# EAGLE schematic ledy  (EAGLE 7.2.0)
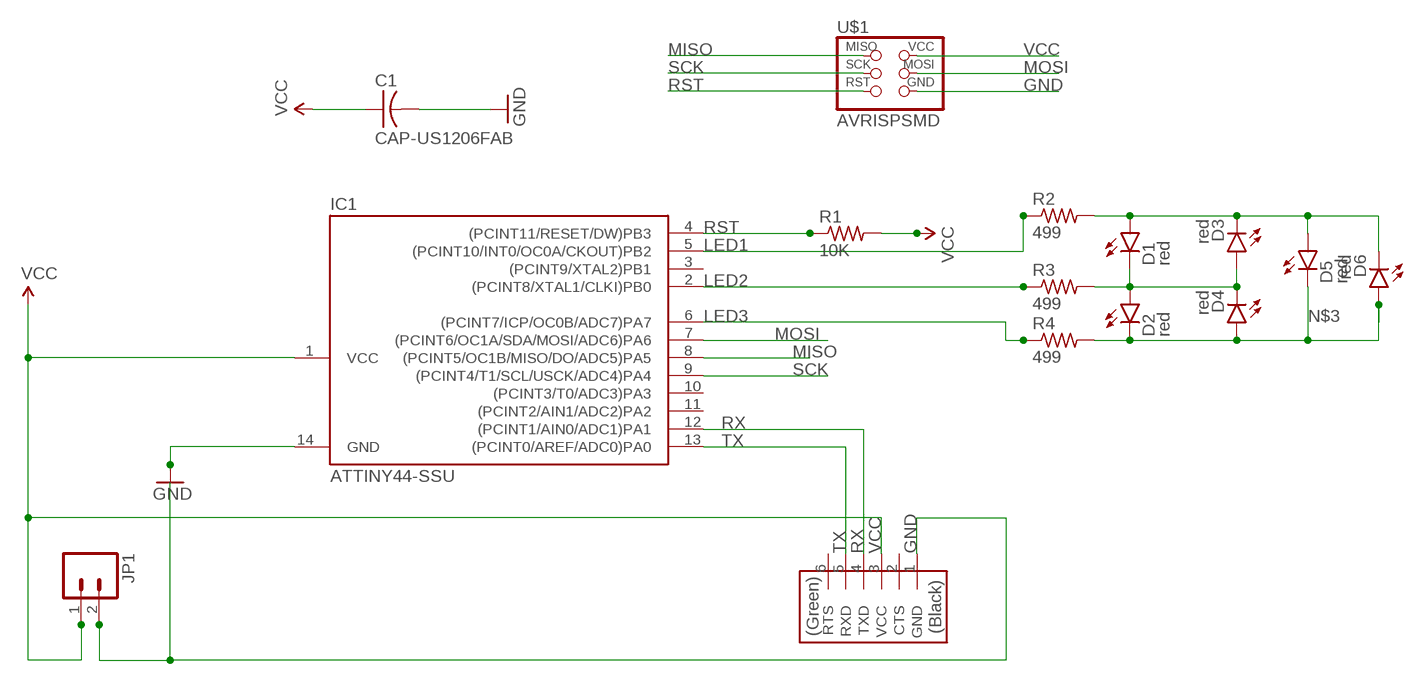
[diagram p0: schematic, sheet 1]

## Parts
C1  CAP-US1206FAB  [C1206FAB]
D1  red  LED1206  [LED-1206]
D2  red  LED1206  [LED-1206]
D3  red  LED1206  [LED-1206]
D4  red  LED1206  [LED-1206]
D5  red  LED1206  [LED-1206]
D6  red  LED1206  [LED-1206]
IC1  ATTINY44-SSU  [SOIC14]
JP1  M02PTH  [1X02]
R1  10K  RES-US1206W  [R1206W]
R2  499  RES-US1206W  [R1206W]
R3  499  RES-US1206W  [R1206W]
R4  499  RES-US1206W  [R1206W]
U$1  AVRISPSMD  [2X03SMD]
U$3  FTDI-SMD-HEADER  [1X06SMD]

## Nets
GND: C1.2 IC1.14(GND) JP1.2 U$1.6(GND) U$3.1(GND)
LED1: IC1.5((PCINT10/INT0/OC0A/CKOUT)PB2) R2.1
LED2: R3.1
LED3: IC1.6((PCINT7/ICP/OC0B/ADC7)PA7) R4.1
MISO: IC1.8((PCINT5/OC1B/MISO/DO/ADC5)PA5) U$1.1(MISO)
MOSI: IC1.7((PCINT6/OC1A/SDA/MOSI/ADC6)PA6) U$1.4(MOSI)
N$3: D1.A D3.C D5.A D6.C R2.2
N$5: D2.C D4.A D5.C D6.A R4.2
N$9: D1.C D2.A D3.A D4.C R3.2
RST: IC1.4((PCINT11/RESET/DW)PB3) R1.1 U$1.5(RST)
RX: IC1.12((PCINT1/AIN0/ADC1)PA1) U$3.4(TXD)
SCK: IC1.9((PCINT4/T1/SCL/USCK/ADC4)PA4) U$1.3(SCK)
TX: IC1.13((PCINT0/AREF/ADC0)PA0) U$3.5(RXD)
VCC: C1.1 IC1.1(VCC) JP1.1 R1.2 U$1.2(VCC) U$3.3(VCC)
Unconnected: IC1.2((PCINT8/XTAL1/CLKI)PB0) IC1.3((PCINT9/XTAL2)PB1) IC1.10((PCINT3/T0/ADC3)PA3) IC1.11((PCINT2/AIN1/ADC2)PA2) U$3.2(CTS) U$3.6(RTS)

## Library data of the parts
C1 = fab:CAP-US
D1-D6 = SparkFun-LED:LED: LEDs Standard schematic elements and footprints for 5mm, 3mm, 1206, and 0603 sized LEDs. 5mm - Spark Fun Electronics SKU : COM-00529 (and others)
IC1 = fab:ATTINY44
JP1 = SparkFun-Connectors:M02: Standard 2-pin 0.1" header. Use with - straight break away headers ( PRT-00116) - right angle break away headers (PRT-00553) - swiss pins (PRT-00743) - machine pins (PRT-00117) - female headers (PRT-00115) Molex polarized connector foot print use with: PRT-08233 with associated crimp pins and housings. 2.54_SCREWTERM for use with PRT-10571. 3.5mm Screw Terminal footprints for PRT-08084 5mm Screw Terminal footprints for use with PRT-08432
R1-R4 = fab:RES-US: Resistor (US Symbol) Variants with postfix FAB are widened to allow the routing of internal traces
U$1 = fab:AVRISP
U$3 = fab:FTDI-SMD-HEADER